# Altium schematic sheet ULA.SchDoc
size A4
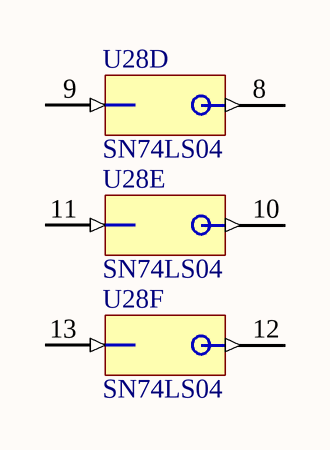
[diagram p0: ULA.SchDoc]

## Parts
U28  SN74LS04  [CDIP14]  (parts D,E,F of 7)

## Nets

Not connected (* = marked no-connect by the designer): U28 8(Y) 9(A) 10(Y) 11(A) 12(Y) 13(A)

## Library data of the parts
U28 = SN74HC04: Hex Inverters